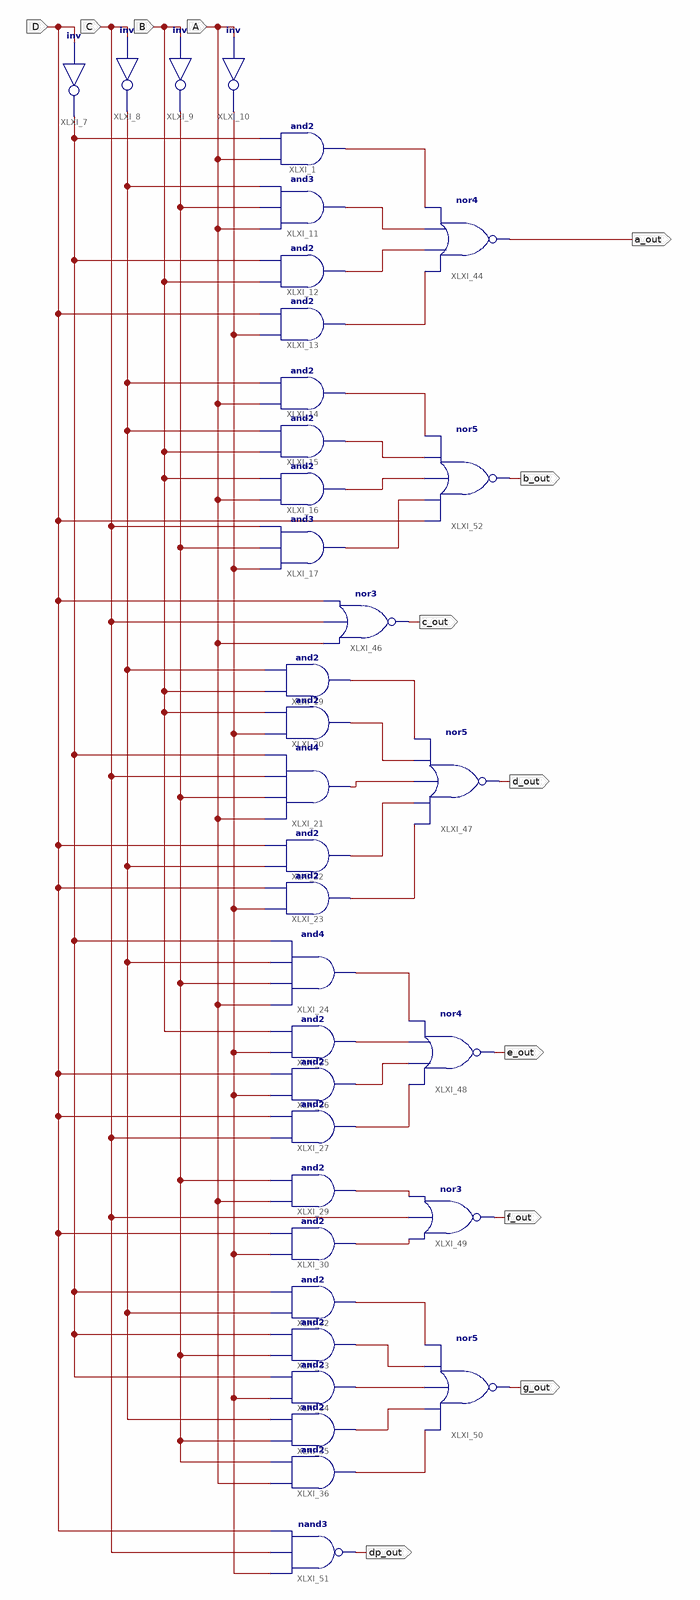
[diagram p0: schematic sheet 1]
// Xilinx ISE schematic CardTo7.sch (spartan3) as structural Verilog: 36 symbols, 12 ports
module CardTo7 (
  input  C,
  input  B,
  input  A,
  input  D,
  output c_out,
  output d_out,
  output e_out,
  output f_out,
  output g_out,
  output dp_out,
  output a_out,
  output b_out
);

  wire XLXN_11, XLXN_12, XLXN_14, XLXN_16, XLXN_21, XLXN_23, XLXN_24, XLXN_25, XLXN_26, XLXN_27, XLXN_28,
       XLXN_29, XLXN_30, XLXN_32, XLXN_33, XLXN_35, XLXN_36, XLXN_37, XLXN_38, XLXN_39, XLXN_40, XLXN_41,
       XLXN_44, XLXN_45, XLXN_46, XLXN_47, XLXN_48, XLXN_62;

  not XLXI_7 (XLXN_11, D);
  not XLXI_8 (XLXN_12, C);
  not XLXI_9 (XLXN_14, B);
  not XLXI_10 (XLXN_16, A);
  and XLXI_1 (XLXN_24, A, XLXN_11);
  and XLXI_11 (XLXN_25, A, XLXN_14, XLXN_12);
  and XLXI_12 (XLXN_26, B, XLXN_11);
  and XLXI_13 (XLXN_27, XLXN_16, D);
  and XLXI_14 (XLXN_28, A, XLXN_12);
  and XLXI_15 (XLXN_29, B, XLXN_12);
  and XLXI_16 (XLXN_30, A, B);
  and XLXI_17 (XLXN_62, XLXN_16, XLXN_14, C);
  and XLXI_19 (XLXN_32, B, XLXN_12);
  and XLXI_20 (XLXN_33, XLXN_16, B);
  and XLXI_21 (XLXN_35, A, XLXN_14, C, XLXN_11);
  and XLXI_22 (XLXN_36, XLXN_12, D);
  and XLXI_23 (XLXN_37, XLXN_16, D);
  and XLXI_24 (XLXN_38, A, XLXN_14, XLXN_12, XLXN_11);
  and XLXI_25 (XLXN_39, XLXN_16, B);
  and XLXI_26 (XLXN_40, XLXN_16, D);
  and XLXI_27 (XLXN_41, C, D);
  and XLXI_29 (XLXN_21, A, XLXN_14);
  and XLXI_30 (XLXN_23, XLXN_16, D);
  and XLXI_32 (XLXN_44, XLXN_12, XLXN_11);
  and XLXI_33 (XLXN_45, XLXN_14, XLXN_11);
  and XLXI_34 (XLXN_46, XLXN_16, XLXN_11);
  and XLXI_35 (XLXN_47, XLXN_14, XLXN_12);
  and XLXI_36 (XLXN_48, A, XLXN_14);
  nor XLXI_44 (a_out, XLXN_27, XLXN_26, XLXN_25, XLXN_24);
  nor XLXI_46 (c_out, A, C, D);
  nor XLXI_47 (d_out, XLXN_37, XLXN_36, XLXN_35, XLXN_33, XLXN_32);
  nor XLXI_48 (e_out, XLXN_41, XLXN_40, XLXN_39, XLXN_38);
  nor XLXI_49 (f_out, XLXN_23, C, XLXN_21);
  nor XLXI_50 (g_out, XLXN_48, XLXN_47, XLXN_46, XLXN_45, XLXN_44);
  nand XLXI_51 (dp_out, XLXN_16, C, D);
  nor XLXI_52 (b_out, D, XLXN_62, XLXN_30, XLXN_29, XLXN_28);
endmodule
